# EAGLE design DRV8825-isolated (EAGLE 7.5.0)
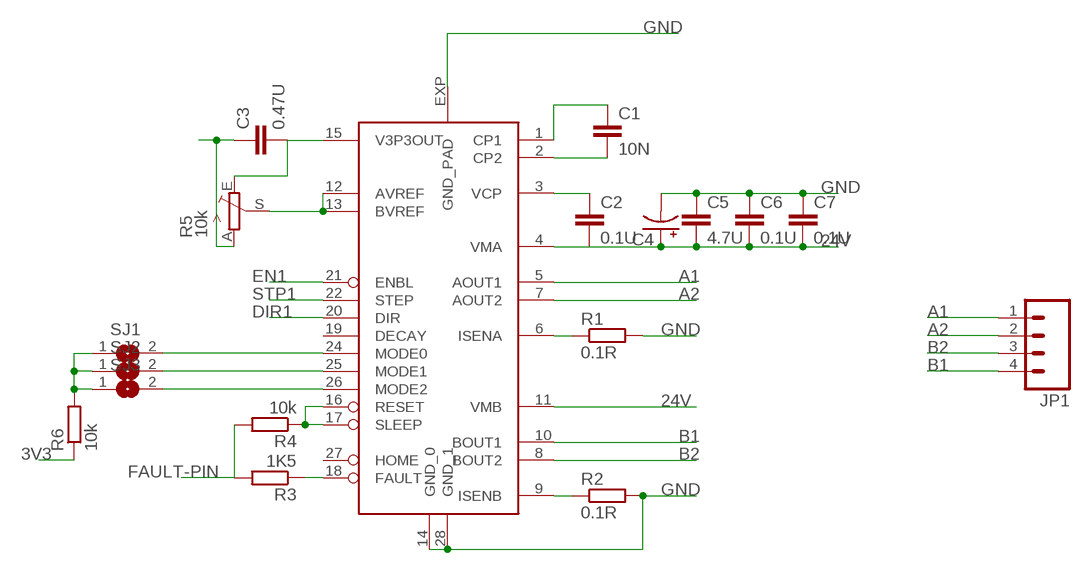
[diagram p0: schematic, sheet 1]

## Parts
C1  10N  CAP1206  [1206]
C2  0.1U  CAP1206  [1206]
C3  0.47U  CAP1206  [1206]
C4  CPOL-USE2.5-7  [E2,5-7]
C5  4.7U  CAP1206  [1206]
C6  0.1U  CAP1206  [1206]
C7  0.1U  CAP1206  [1206]
JP1  M04SCREW  [SCREWTERMINAL-3.5MM-4]
R1  0.1R  R-EU_R1206  [R1206]
R2  0.1R  R-EU_R1206  [R1206]
R3  1K5  R-EU_M1206  [M1206]
R4  10k  R-EU_M1206  [M1206]
R5  10k  TRIM_EU-S64W  [S64W]
R6  10k  R-EU_R1206  [R1206]
SJ1  SJ  [SJ]
SJ2  SJ  [SJ]
SJ3  SJ  [SJ]
U$1  DRV8825PWP  [TSSOP-28]

## Nets
3V3: R6.1
24V: C2.2 C4.+ C5.2 C6.2 C7.2 U$1.4(VMA) U$1.11(VMB)
A1: JP1.1 U$1.5(AOUT1)
A2: JP1.2 U$1.7(AOUT2)
B1: JP1.4 U$1.10(BOUT1)
B2: JP1.3 U$1.8(BOUT2)
CP1: C1.1 U$1.1(CP1)
CP2: C1.2 U$1.2(CP2)
DIR1: U$1.20(DIR)
EN1: U$1.21(ENBL)
FAULT: R3.1 U$1.18(FAULT)
FAULT-PIN: R3.2 R4.2
GND: C3.1 C4.- C5.1 C6.1 C7.1 R1.2 R2.2 R5.A U$1.14(GND_0) U$1.28(GND_1) U$1.EXP(GND_PAD)
MSPULLUP: R6.2 SJ1.1 SJ1.2 SJ2.1 SJ2.2 SJ3.1 SJ3.2 U$1.24(MODE0) U$1.25(MODE1) U$1.26(MODE2)
N$2: R5.S U$1.12(AVREF) U$1.13(BVREF)
SENA: R1.1 U$1.6(ISENA)
SENB: R2.1 U$1.9(ISENB)
SLEEP: R4.1 U$1.16(RESET) U$1.17(SLEEP)
STP1: U$1.22(STEP)
V3VP: C3.2 R5.E U$1.15(V3P3OUT)
VCP: C2.1 U$1.3(VCP)
Unconnected: U$1.19(DECAY) U$1.27(HOME)

## Library data of the parts
C1-C3 C5-C7 = SparkFun-Capacitors:CAP: Capacitor Standard 0603 ceramic capacitor, and 0.1" leaded capacitor.
C4 = adafruit:CPOL-US: POLARIZED CAPACITOR, American symbol
JP1 = SparkFun-Connectors:M04: Header 4 Standard 4-pin 0.1" header. Use with straight break away headers (SKU : PRT-00116), right angle break away headers (PRT-00553), swiss pins (PRT-00743), machine pins (PRT-00117), and female headers (PRT-00115). Molex polarized connector foot print use with SKU : PRT-08231 with associated crimp pins and housings. 1MM SMD Version SKU: PRT-10208; PROD_ID: Combine 2x8399
R1-R4 R6 = rcl:R-EU_: RESISTOR, European symbol
R5 = pot:TRIM_EU-: POTENTIOMETER
SJ1-SJ3 = jumper:SJ: SMD solder JUMPER
U$1 = drv88xx:DRV8825PWP

## Net classes
1 power: width 0.6 mm, clearance 0.305 mm

## Board
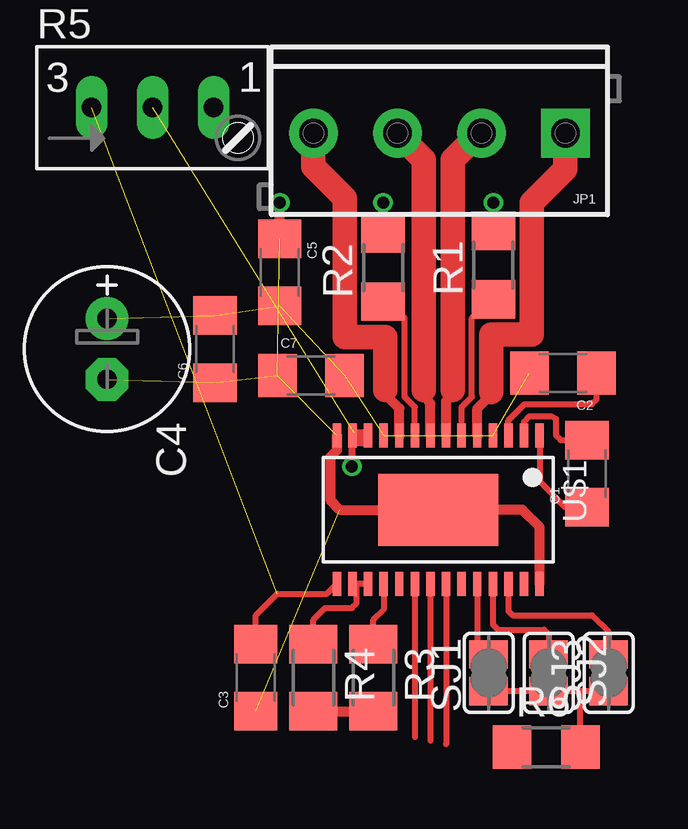
[diagram p1: board, top side]
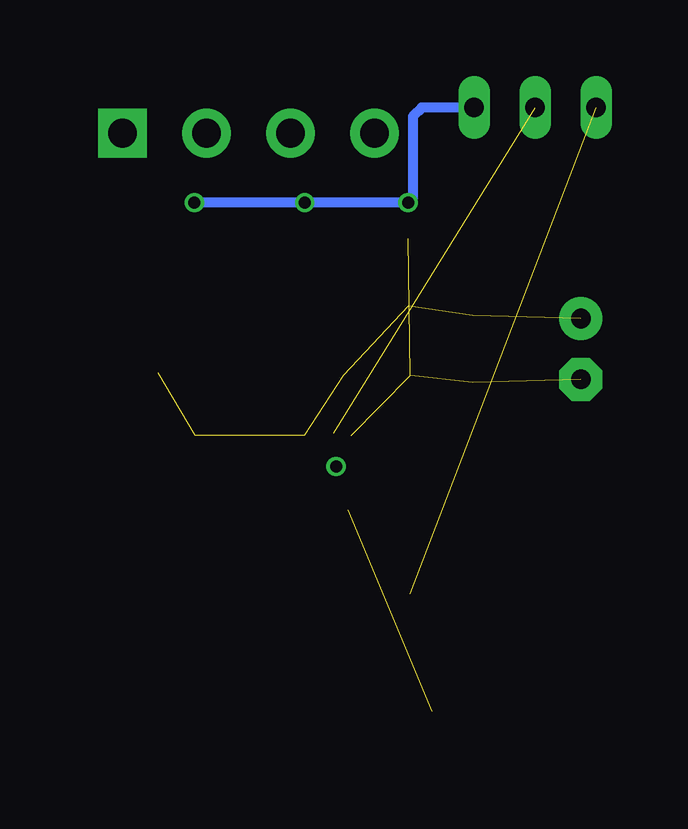
[diagram p2: board, bottom side, seen from below]

No outline drawn. Coordinates in mm, seen from the top.
Copper layers (1*16): Top 0.035mm / dielectric 1.5mm / Bottom 0.035mm
Design rules "dirt_cheap_dirty_boards.v1": minimum track width 5mil, minimum drill 12mil, track to track 5mil, track to pad 5mil, pad to pad 5mil, via to via 5mil, smd to smd 0mil, copper to edge 10mil, drill to drill 10mil, minimum pad ring 10mil, minimum via ring 6mil, stop-mask expansion 2mil, vias tented up to drill 25mil, thermal gap 10mil

### Footprints (pad centres in the part's own frame; a part is rotated, then mirrored left to right if it is on the bottom)
1206 = smd 1.6 x 1.8: 1 -1.4,0; 2 1.4,0
E2,5-7 = drill 0.813 pad 1.778: + -1.27,0 | drill 0.813 pad 1.778 octagon: - 1.27,0
SCREWTERMINAL-3.5MM-4 = drill 1.2 pad 2.032 square: 1 0,0 | drill 1.2 pad 2.032: 2 3.5,0; 3 7,0; 4 10.5,0
R1206 = smd 1.6 x 1.803: 1 -1.422,0; 2 1.422,0
M1206 = smd 1.6 x 2: 1 -1.4,0; 2 1.4,0
S64W = drill 0.813 long: A 2.54,1.27; E -2.54,1.27; S 0,1.27
SJ = smd 1.168 x 1.6: 1 -0.762,0; 2 0.762,0
TSSOP-28 = smd 0.35 x 1: 1 -4.225,-3.087; 2 -3.575,-3.087; 3 -2.925,-3.087; 4 -2.275,-3.087; 5 -1.625,-3.087; 6 -0.975,-3.087; 7 -0.325,-3.087; 8 0.325,-3.087; 9 0.975,-3.087; 10 1.625,-3.087; 11 2.275,-3.087; 12 2.925,-3.087; 13 3.575,-3.087; 14 4.225,-3.087; 15 4.225,3.087; 16 3.575,3.087; 17 2.925,3.087; 18 2.275,3.087; 19 1.625,3.087; 20 0.975,3.087; 21 0.325,3.087; 22 -0.325,3.087; 23 -0.975,3.087; 24 -1.625,3.087; 25 -2.275,3.087; 26 -2.925,3.087; 27 -3.575,3.087; 28 -4.225,3.087 | smd 5 x 3: EXP 0,0

### Placement (x,y rotation side)
C1  23.6,11.4 90 top
C2  22.6,15.6 180 top
C3  9.8,2.9 90 top
C4  3.6,16.6 270 top
C5  10.8,19.8 270 top
C6  8.1,16.6 90 top
C7  12.1,15.5 0 top
JP1  22.7,25.6 180 top
R1  19.7,20.1 90 top
R2  15.1,20 90 top
R3  14.7,2.9 270 top
R4  12.2,2.9 270 top
R5  5.5,25.4 0 top
R6  21.9,0 0 top
SJ1  19.5,3.1 90 top
SJ2  22,3.1 270 top
SJ3  24.5,3.1 90 top
U$1  17.4,9.9 180 top

### Tracks (layer width: path | path; a pad name or v marks a point on that pad's centre or on a via)
24V  (6 unrouted)
A1
  Top 0.406: U$1.5 19.02,14.12 19.6,14.7 19.6,14.8
  Top 1.016: JP1.1 22.7,24.1 21.3,22.7 21.3,17.2 19.6,17.2 19.6,14.8
A2
  Top 0.406: U$1.7 17.73,14.43 18,14.7 18,14.9
  Top 1.016: JP1.2 19.1,25.6 18,24.5 18,14.9
B1
  Top 0.406: U$1.10 15.78,14.12 15.2,14.7 15.2,14.9
  Top 1.016: JP1.4 12.2,24.2 13.5,22.9 13.5,17.1 15.2,17.1 15.2,14.9
B2
  Top 0.406: U$1.8 17.07,14.32 16.8,14.7 16.8,14.9
  Top 1.016: JP1.3 16.8,24.5 16.8,14.9
CP1
  Top 0.254: U$1.1 21.62,11.07 22.7,10 C1.1
CP2
  Top 0.254: U$1.2 20.98,13.57 21.2,13.8 22.1,13.8 22.3,13.7 22.3,13 22.5,12.8 C1.2
DIR1
  Top 0.254: U$1.20 16.43,0.42
EN1
  Top 0.254: U$1.21 17.07,0.28
FAULT
  Top 0.254: R3.1 14.7,5.3 15.12,5.72 U$1.18
FAULT-PIN
  Top 0.406: R4.2 R3.2
GND  (via drill 0.5)  (5 unrouted)
  Top 0.406: R2.2 v15.1,22.7 | v19.7,22.7 R1.2 | U$1.28 21.62,9.18 20.9,9.9 U$1.EXP 13.3,9.9 12.9,10.3 12.9,12.1 13.18,12.38 U$1.14 | C5.1 v10.8,22.7
  Bottom 0.406: v19.7,22.7 v15.1,22.7 v10.8,22.7 10.6,22.9 10.6,26.3 10.23,26.67 R5.A
MSPULLUP
  Top 0.254: U$1.24 19.02,4.34 SJ1.2 SJ1.1 SJ2.2 | U$1.25 19.68,5.12 19.9,4.9 21.8,4.9 22,4.7 SJ2.1 SJ2.2 | U$1.26 20.32,5.67 20.5,5.5 23.8,5.5 24.5,4.8 SJ3.2 SJ3.1 23.3,2.34 | 23.3,2.34 SJ2.2 | R6.2 23.32,2.32 23.3,2.34
N$2  (via drill 0.5)  (1 unrouted)
  Top 0.3: U$1.12 U$1.13 14.09,12.99 14.1,13 | 14.1,13 14.4,13 14.5,13.1 14.2,13.1 | 14.2,13.1 14.1,13 | 14.1,13 14.1,13.1 | 14.1,13.1 13.9,13.1 | 14.1,13.1 14.2,13.1 | 14.2,13.1 14.2,12.8 14.1,12.8 13.8,12.7 | 13.8,12.7 14.3,12.7 | 13.8,12.7 v13.8,11.7
SENA
  Top 0.254: U$1.6 18.38,14.18 18.8,14.6 18.8,17.9 19,18.1 19.42,18.1 R1.1
SENB
  Top 0.254: U$1.9 16.43,14.18 16,14.6 16,17.9 15.6,18.3 15.18,18.3 R2.1
SLEEP
  Top 0.254: R4.1 12.2,5.3 12.7,5.8 13.8,5.8 14,6 14,6.64 U$1.16 U$1.17
STP1
  Top 0.254: U$1.22 17.73,0.12
V3VP  (1 unrouted)
  Top 0.254: C3.2 9.8,5.5 10.7,6.4 12.76,6.4 U$1.15
VCP
  Top 0.254: U$1.3 20.32,13.62 21,14.3 23.8,14.3 24,14.5 C2.1

### Text on the board
tNames: PWM1